# Altium schematic sheet CN3791_solar.SchDoc
size A; SheetNumber: 2; SheetTotal: 6
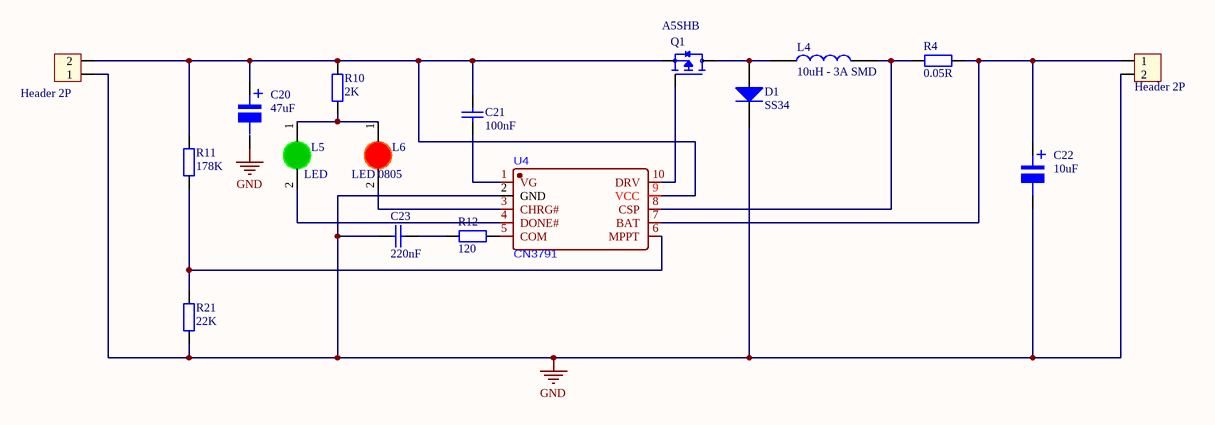
[diagram p0: CN3791_solar.SchDoc]

## Parts
C20  47uF  [tu nhom 5 (c)]
C21  100nF  [tu 0805]
C22  10uF  [tu nhom 5 (c)]
C23  220nF  [tu 0805]
D1  SS34  [DIODE SMA]
H2  Header 2P  [XH2.54M-2]
H3  Header 2P  [XH2.54M-2]
L4  10uH - 3A SMD  [CUON CAM SMD 0530]
L5  LED  [LED-0805-Green]
L6  LED 0805  [LED-0805-Red]
Q1  A5SHB  [TRANS_MMFTP2319]
R4  0.05R  [tro smd 2512]
R10  2K  [tro smd 0805]
R11  178K  [tro smd 0805]
R12  120  [tro smd 0805]
R21  22K  [tro smd 0805]
U4  CN3791  [SSOP-10_L4.9-W3.9-P1.00-LS6.0-BL]

## Nets
GND: C20.2 C22.2 C23.2 D1.2(K) H2.1 H3.2 R21.1 U4.2(GND)
NetC20_1: C20.1 C21.1 H2.2 Q1.2(S) R10.2 R11.2 U4.9(VCC)
NetC21_2: C21.2 U4.1(VG)
NetC22_1: C22.1 H3.1 R4.2 U4.7(BAT)
NetC23_1: C23.1 R12.1
NetD1_1: D1.1(A) L4.1 Q1.3(D)
NetL4_2: L4.2 R4.1 U4.8(CSP)
NetL5_1: L5.1(A) L6.1(A) R10.1
NetL5_2: L5.2(K) U4.4(DONE#)
NetL6_2: L6.2(K) U4.3(CHRG#)
NetQ1_1: Q1.1(G) U4.10(DRV)
NetR11_1: R11.1 R21.2 U4.6(MPPT)
NetR12_2: R12.2 U4.5(COM)

## Notes on the sheet
- (in symbol Tu Nhom 10uF 20V) +

## Library data of the parts
C20 C22 = Tu Nhom 10uF 20V: Dán; Don_Vi: Con; So_Chan: 2; Ten_Linh_Kien: Tụ Nhôm 10uF 20V; Ma_Hang: MH004016; Chung_Loai: Dán; Kieu_Chan: *
C21 C23 = Tu 0805 33nF 50V 20%: Dán; Don_Vi: Con; So_Chan: 2; Ten_Linh_Kien: Tụ 0805 33nF 50V 20%; Ma_Hang: MH007854; Kieu_Chan: *; Chung_Loai: Dán
D1 = Diode SS34 ( 1N5822 ): Dán; Don_Vi: Con; Ma_Hang: MH002104; Ten_Linh_Kien: Diode SS34 3A 40V SMA ( 1N5822 SS34A); Kieu_Chan: *; Chung_Loai: Dán
H2 H3 = Header 2P 2.54 Duc Thang: Cắm; Ten_Linh_Kien: Header 2P XH2.54-2P Đực Thẳng; Don_Vi: Con; Ma_Hang: MH001283; Chung_Loai: Cắm
L4 = CUON CAM 100uH SMD: Dán; Don_Vi: Con; Ma_Hang: MH003999; Ten_Linh_Kien: Cuộn Cảm 100uH 7x7x4MM CD74; Ma_Hang: *; Kieu_Chan: *; Chung_Loai: Dán
L5 = LED 0805 Xanh La: Dán; Don_Vi: Con; Ma_Hang: MH002326; Ten_Linh_Kien: LED 0805 Màu Xanh Lá (Green); Ghi_Chu: *; Kieu_Chan: *; Chung_Loai: Dán
L6 = LED 0805 Do: Dán; Don_Vi: Con; Ma_Hang: MH000897; Ten_Linh_Kien: LED 0805 Màu Đỏ (Red); Ghi_Chu: *; Kieu_Chan: *; Chung_Loai: Dán
Q1 = MMFTP2319: MOSFET, SOT-23, P, -40V, -4.2A, 0.08â„¦, 150Â°C; MF: Diotec Semiconductor; SnapEDA_Link: https://www.snapeda.com/parts/MMFTP2319/Diotec/view-part/?ref=snap; Package: SOT-23 Diotec; Value: *; MP: MMFTP2319; Check_prices: https://www.snapeda.com/parts/MMFTP2319/Diotec/view-part/?ref=eda
R4 = Tro 2512 5% 0.5R: Dán; Don_Vi: Con; So_Chan: 2; Ten_Linh_Kien: Trở 2512 5% R500-0.5R 1W; Ma_Hang: MH003431; Chung_Loai: Dán; Kieu_Chan: *
R10-R12 R21 = Tro 0805 1% 1k: Dán; Don_Vi: Con; So_Chan: 2; Ten_Linh_Kien: Trở 0805 1% 1k; Ma_Hang: MH005468; Chung_Loai: Dán; Kieu_Chan: *